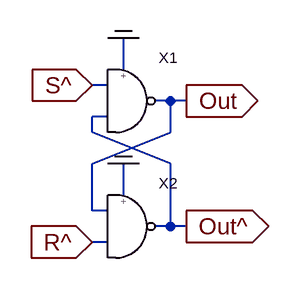
[diagram p0: schematic nm_sr.asc]
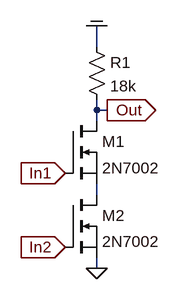
[diagram p1: sub-circuit nm_nand.asc]
nm_sr.asc, the LTspice schematic file:
Version 4
SHEET 1 880 680
WIRE 224 32 224 0
WIRE 208 48 192 48
WIRE 272 64 256 64
WIRE 288 64 272 64
WIRE 208 80 192 80
WIRE 192 96 192 80
WIRE 272 96 272 64
WIRE 192 128 272 96
WIRE 272 128 192 96
WIRE 224 160 224 128
WIRE 192 176 192 128
WIRE 208 176 192 176
WIRE 272 192 272 128
WIRE 272 192 256 192
WIRE 288 192 272 192
WIRE 208 208 192 208
FLAG 192 48 S^
IOPIN 192 48 In
FLAG 288 64 Out
IOPIN 288 64 Out
FLAG 224 0 COM
FLAG 192 208 R^
IOPIN 192 208 In
FLAG 224 128 COM
FLAG 288 192 Out^
IOPIN 288 192 Out
SYMBOL nm_nand 224 64 R0
SYMATTR InstName X1
SYMBOL nm_nand 224 192 R0
SYMATTR InstName X2

nm_nand.asc, the sub-circuit schematic file:
Version 4
SHEET 1 880 680
WIRE 224 32 224 0
WIRE 224 128 224 112
WIRE 240 128 224 128
WIRE 224 144 224 128
WIRE 224 256 224 240
WIRE 224 368 224 352
FLAG 176 224 In1
IOPIN 176 224 In
FLAG 240 128 Out
IOPIN 240 128 Out
FLAG 224 0 COM
FLAG 224 368 0
FLAG 176 336 In2
IOPIN 176 336 In
SYMBOL nmos 176 144 R0
SYMATTR InstName M1
SYMATTR Value 2N7002
SYMBOL res 208 16 R0
SYMATTR InstName R1
SYMATTR Value 18k
SYMBOL nmos 176 256 R0
SYMATTR InstName M2
SYMATTR Value 2N7002

The netlist it stands for:
* nm_sr.asc
XX1 Out^ Out COM S^ nm_nand
XX2 R^ Out^ COM Out nm_nand

* block symbol definitions
.subckt nm_nand In2 Out COM In1
M1 Out In1 N001 N001 2N7002
R1 COM Out 18k
M2 N001 In2 0 0 2N7002
.ends nm_nand

.model NMOS NMOS
.model PMOS PMOS
.lib standard.mos
.backanno
.end